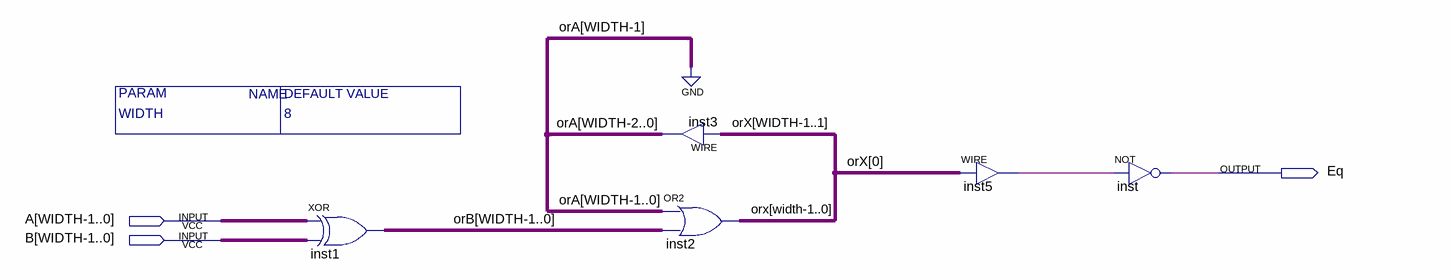
[diagram p0: schematic sheet]
// Quartus schematic wb_block_busEqual.bdf as structural Verilog: 5 symbols, 3 pins
module wb_block_busEqual #(parameter WIDTH = 8) (
  input  [7:0] A,
  input  [7:0] B,
  output Eq
);

  wire inst5_out;
  wire [6:0] orA;
  wire [7:0] orB, orX;

  assign orB = A ^ B;  // XOR inst1, 8 bits wide
  assign orA = orX[7:1];  // WIRE inst3
  assign orX = {1'b0, orA} | orB;  // OR2 inst2, 8 bits wide
  assign inst5_out = orX[0];  // WIRE inst5
  not inst (Eq, inst5_out);
endmodule
